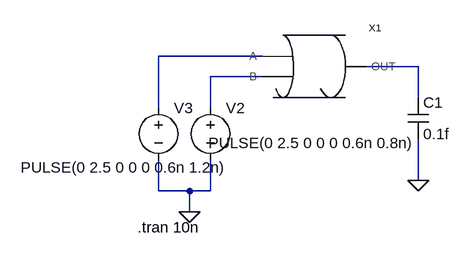
[diagram p0: schematic nor1x2sim.asc]
nor1x2sim.asc, the LTspice schematic file:
Version 4
SHEET 1 880 680
WIRE 96 112 -64 112
WIRE 336 128 256 128
WIRE 96 144 16 144
WIRE 336 176 336 128
WIRE -64 192 -64 112
WIRE 16 192 16 144
WIRE 336 304 336 240
WIRE -64 320 -64 272
WIRE -16 320 -64 320
WIRE 16 320 16 272
WIRE 16 320 -16 320
WIRE -16 352 -16 320
FLAG -16 352 0
FLAG 336 304 0
SYMBOL voltage 16 176 R0
WINDOW 3 -3 70 Left 2
WINDOW 123 0 0 Left 2
WINDOW 39 0 0 Left 2
SYMATTR Value PULSE(0 2.5 0 0 0 0.6n 0.8n)
SYMATTR InstName V2
SYMBOL voltage -64 176 R0
WINDOW 3 -212 108 Left 2
WINDOW 123 0 0 Left 2
WINDOW 39 0 0 Left 2
SYMATTR Value PULSE(0 2.5 0 0 0 0.6n 1.2n)
SYMATTR InstName V3
SYMBOL cap 320 176 R0
SYMATTR InstName C1
SYMATTR Value 0.1f
SYMBOL nor1x2 128 112 R0
SYMATTR InstName X1
TEXT -96 376 Left 2 !.tran 10n

The netlist it stands for:
* nor1x2sim.asc
V2 N003 0 PULSE(0 2.5 0 0 0 0.6n 0.8n)
V3 N001 0 PULSE(0 2.5 0 0 0 0.6n 1.2n)
C1 N002 0 0.1f
XX1 N001 N003 N002 nor1x2  ; pins A B OUT
.tran 10n
.backanno
.end